# Altium schematic sheet mcu.SchDoc
size A4
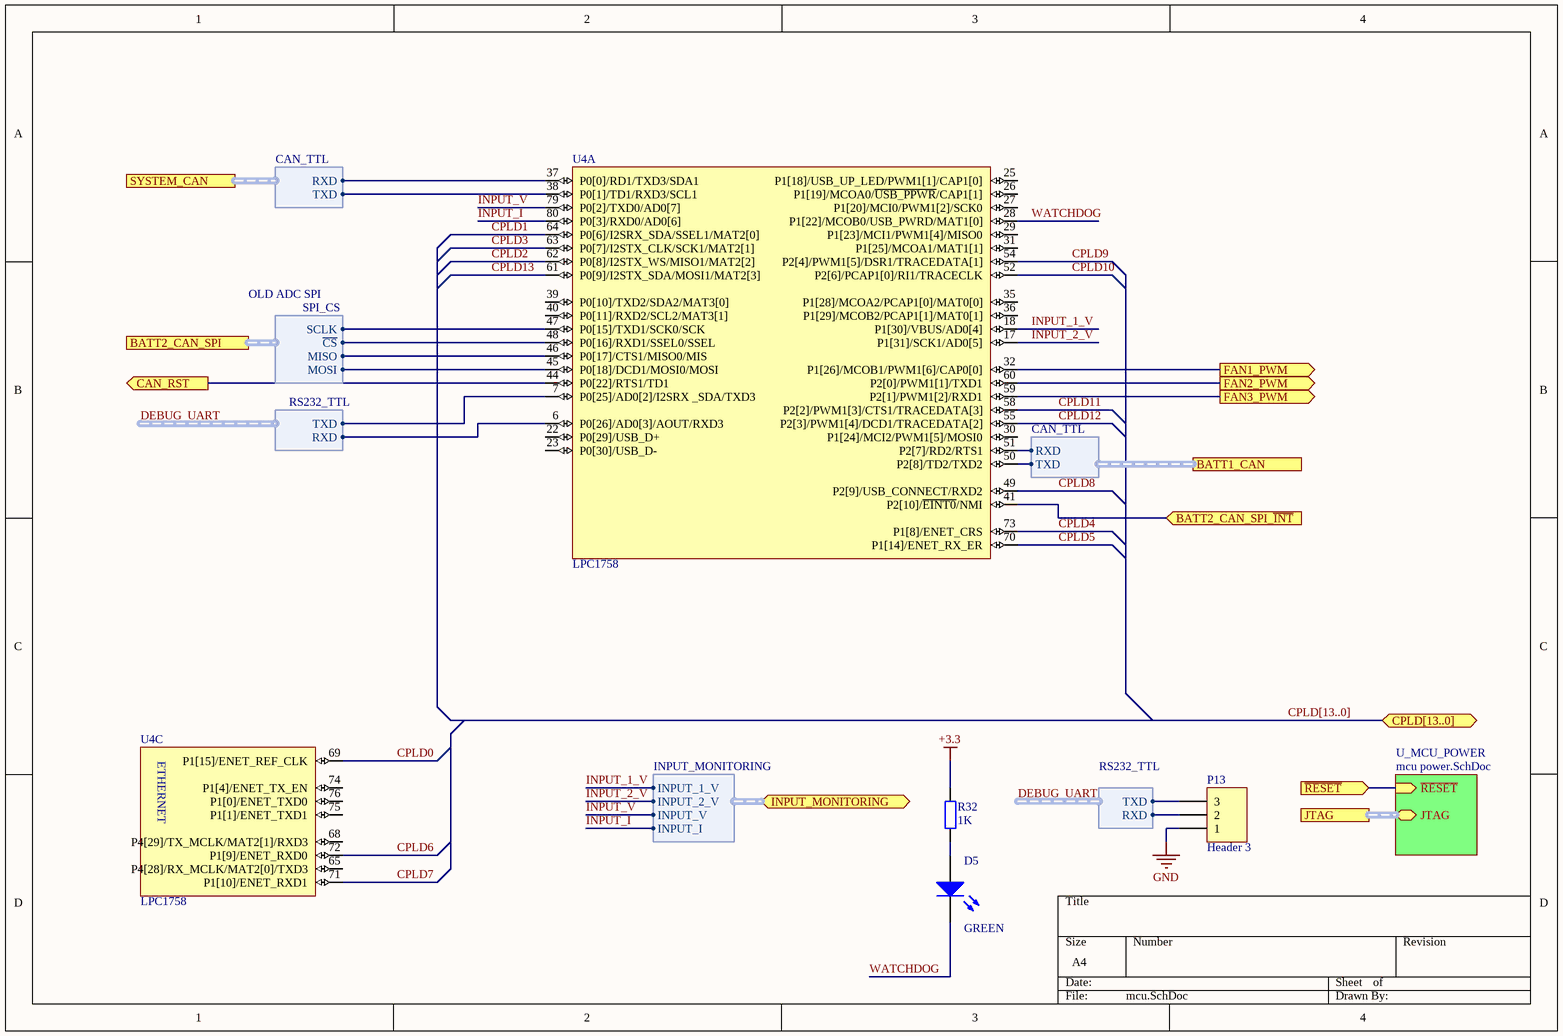
[diagram p0: mcu.SchDoc]

## Parts
D5  value GREEN  [LGQ971]
P13  Header 3  [HDR1X3]
R32  value 1K  [R0603]  (hidden comment: Res)
U4  LPC1758  [LPC1758FBD80]  (parts A,C of 3)

## Sub-sheets
U_MCU_POWER = mcu power.SchDoc: JTAG (harness ARM_JTAG), ~{RESET} (in)

## Ports
BATT1_CAN (harness CAN_TTL), BATT2_CAN_SPI (harness SPI_CS), BATT2_CAN_SPI_~{INT} (in), CAN_RST (out), CPLD[13..0] (bidir), FAN1_PWM (out), FAN2_PWM (out), FAN3_PWM (out), INPUT_MONITORING (harness INPUT_MONITORING), JTAG (harness ARM_JTAG), SYSTEM_CAN (harness CAN_TTL), ~{RESET} (in)

## Harnesses
CAN_TTL: RXD, TXD
SPI_CS: ~{CS}, MISO, MOSI, SCLK
RS232_TTL: RXD, TXD
INPUT_MONITORING: INPUT_1_V, INPUT_2_V, INPUT_I, INPUT_V

## Nets
+3.3: R32.2
GND: P13.1
BATT2_CAN_SPI_~{INT}: U4.41(P2[10]/~{EINT0}/NMI) ; port BATT2_CAN_SPI_~{INT}
CAN_RST: U4.44(P0[22]/RTS1/TD1) ; port CAN_RST
CPLD0: U4.69(P1[15]/ENET_REF_CLK)
CPLD1: U4.64(P0[6]/I2SRX_SDA/SSEL1/MAT2[0])
CPLD2: U4.62(P0[8]/I2STX_WS/MISO1/MAT2[2])
CPLD3: U4.63(P0[7]/I2STX_CLK/SCK1/MAT2[1])
CPLD4: U4.73(P1[8]/ENET_CRS)
CPLD5: U4.70(P1[14]/ENET_RX_ER)
CPLD6: U4.72(P1[9]/ENET_RXD0)
CPLD7: U4.71(P1[10]/ENET_RXD1)
CPLD8: U4.49(P2[9]/USB_CONNECT/RXD2)
CPLD9: U4.54(P2[4]/PWM1[5]/DSR1/TRACEDATA[1])
CPLD10: U4.52(P2[6]/PCAP1[0]/RI1/TRACECLK)
CPLD11: U4.58(P2[2]/PWM1[3]/CTS1/TRACEDATA[3])
CPLD12: U4.55(P2[3]/PWM1[4]/DCD1/TRACEDATA[2])
CPLD13: U4.61(P0[9]/I2STX_SDA/MOSI1/MAT2[3])
DEBUG_UART.RXD: P13.2 U4.6(P0[26]/AD0[3]/AOUT/RXD3) ; harness RS232_TTL.RXD
DEBUG_UART.TXD: P13.3 U4.7(P0[25]/AD0[2]/I2SRX__SDA/TXD3) ; harness RS232_TTL.TXD
FAN1_PWM: U4.32(P1[26]/MCOB1/PWM1[6]/CAP0[0]) ; port FAN1_PWM
FAN2_PWM: U4.60(P2[0]/PWM1[1]/TXD1) ; port FAN2_PWM
FAN3_PWM: U4.59(P2[1]/PWM1[2]/RXD1) ; port FAN3_PWM
INPUT_1_V: U4.18(P1[30]/VBUS/AD0[4]) ; port INPUT_MONITORING.INPUT_1_V
INPUT_2_V: U4.17(P1[31]/SCK1/AD0[5]) ; port INPUT_MONITORING.INPUT_2_V
INPUT_I: U4.80(P0[3]/RXD0/AD0[6]) ; port INPUT_MONITORING.INPUT_I
INPUT_V: U4.79(P0[2]/TXD0/AD0[7]) ; port INPUT_MONITORING.INPUT_V
~{RESET}: port ~{RESET}, sheet U_MCU_POWER/~{RESET}
WATCHDOG: D5.2(K) U4.28(P1[22]/MCOB0/USB_PWRD/MAT1[0])
NetD5_1: D5.1(A) R32.1
NetU4_37: U4.37(P0[0]/RD1/TXD3/SDA1) ; port SYSTEM_CAN.RXD
NetU4_38: U4.38(P0[1]/TD1/RXD3/SCL1) ; port SYSTEM_CAN.TXD
NetU4_45: U4.45(P0[18]/DCD1/MOSI0/MOSI) ; port BATT2_CAN_SPI.MOSI
NetU4_46: U4.46(P0[17]/CTS1/MISO0/MIS) ; port BATT2_CAN_SPI.MISO
NetU4_47: U4.47(P0[15]/TXD1/SCK0/SCK) ; port BATT2_CAN_SPI.SCLK
NetU4_48: U4.48(P0[16]/RXD1/SSEL0/SSEL) ; port BATT2_CAN_SPI.~{CS}
NetU4_50: U4.50(P2[8]/TD2/TXD2) ; port BATT1_CAN.TXD
NetU4_51: U4.51(P2[7]/RD2/RTS1) ; port BATT1_CAN.RXD

Not connected (* = marked no-connect by the designer): U4 22(P0[29]/USB_D+) 23(P0[30]/USB_D-) 25(P1[18]/USB_UP_LED/PWM1[1]/CAP1[0]) 26(P1[19]/MCOA0/~{USB_PPWR}/CAP1[1]) 27(P1[20]/MCI0/PWM1[2]/SCK0) 29(P1[23]/MCI1/PWM1[4]/MISO0) 30(P1[24]/MCI2/PWM1[5]/MOSI0) 31(P1[25]/MCOA1/MAT1[1]) 35(P1[28]/MCOA2/PCAP1[0]/MAT0[0]) 36(P1[29]/MCOB2/PCAP1[1]/MAT0[1]) 39(P0[10]/TXD2/SDA2/MAT3[0]) 40(P0[11]/RXD2/SCL2/MAT3[1]) 65(P4[28]/RX_MCLK/MAT2[0]/TXD3) 68(P4[29]/TX_MCLK/MAT2[1]/RXD3) 74(P1[4]/ENET_TX_EN) 75(P1[1]/ENET_TXD1) 76(P1[0]/ENET_TXD0)

## Buses and harness runs
bus CPLD[13..0] = port CPLD[13..0]
harness port JTAG = sheet U_MCU_POWER/JTAG

## Notes on the sheet
- OLD ADC SPI
- (in symbol LPC1758, part C) ETHERNET

## Library data of the parts
D5 = LED2: Typical RED, GREEN, YELLOW, AMBER GaAs LED; farnell: 1226372
P13 = Header 3: Header, 3-Pin; LatestRevisionDate: 17-Jul-2002; LatestRevisionNote: Re-released for DXP Platform.; Publisher: Altium Limited
R32 = Res2: Resistor; farnell: 9330380
U4 = LPC1758: NXP - LPC1758FBD80 - MCU, 32BIT, ARM CORTEX M3, 80LQFP; farnell: 1718545